# Altium schematic sheet REGENIX_DRIVER.SchDoc
size A4; SheetNumber: 11; SheetTotal: 12
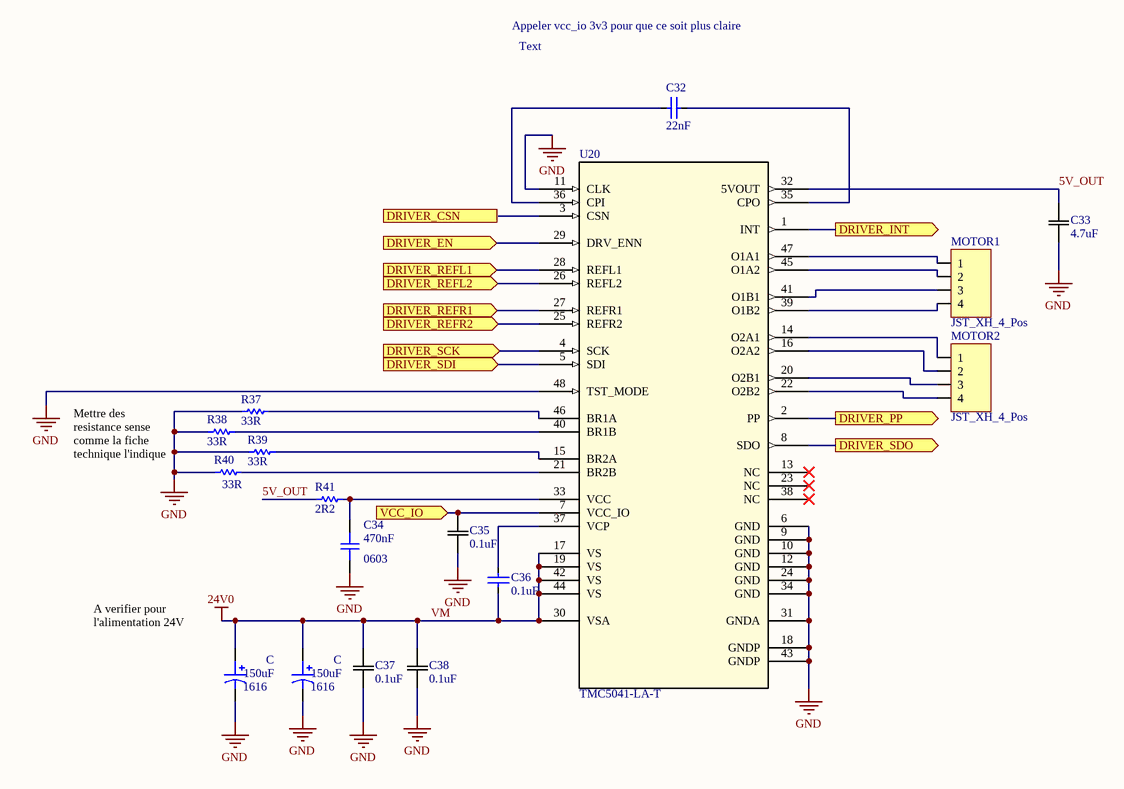
[diagram p0: REGENIX_DRIVER.SchDoc]

## Parts
(Parts that share a designator on the sheet are numbered #1, #2 ... from top to bottom, then left to right.)
C32  value 22nF  [CAPACITOR-0603]  (hidden comment: Capacitor-0603-0.22uF-25V-X7R)
C33  4.7uF  [CAP_CL21_SAM]
C34  value 470nF  Package: 0603  [CAP_0603]  (hidden comment: CAP - 0603)
C35  0.1uF  [CAP_CL10_SAM]
C36  value 0.1uF  [CAPACITOR-0603]  (hidden comment: Capacitor-0603-0.22uF-25V-X7R)
C37  0.1uF  [CAP_CL10_SAM]
C38  0.1uF  [CAP_CL10_SAM]
C#1  value 150uF  Package: 1616  [CAP_ALU_1616_vishay]  (hidden comment: MAL214699108E3)
C#2  value 150uF  Package: 1616  [CAP_ALU_1616_vishay]  (hidden comment: MAL214699108E3)
MOTOR1  JST_XH_4_Pos  [JST_XH_4_Pos]
MOTOR2  JST_XH_4_Pos  [JST_XH_4_Pos]
R37  value 33R  [RESISTOR-1206]  (hidden comment: SMT resistor)
R38  value 33R  [RESISTOR-1206]  (hidden comment: SMT resistor)
R39  value 33R  [RESISTOR-1206]  (hidden comment: SMT resistor)
R40  value 33R  [RESISTOR-1206]  (hidden comment: SMT resistor)
R41  value 2R2  [Resistor-0603]  (hidden comment: SMT resistor)
U20  TMC5041-LA-T  [QFN48_7X7_TRI]

## Ports
DRIVER_CSN (in), DRIVER_EN (in), DRIVER_INT (out), DRIVER_PP (out), DRIVER_REFL1 (in), DRIVER_REFL2 (in), DRIVER_REFR1 (in), DRIVER_REFR2 (in), DRIVER_SCK (in), DRIVER_SDI (in), DRIVER_SDO (out), VCC_IO (in)

## Nets
GND: C33.1 C34.1 C35.1 C37.1 C38.1 C#1.2 C#2.2 R37.1 R38.1 R39.1 R40.1 U20.6(GND) U20.9(GND) U20.10(GND) U20.11(CLK) U20.12(GND) U20.18(GNDP) U20.24(GND) U20.31(GNDA) U20.34(GND) U20.43(GNDP) U20.48(TST_MODE)
VM: C36.1 C37.2 C38.2 C#1.1 C#2.1 U20.17(VS) U20.19(VS) U20.30(VSA) U20.42(VS) U20.44(VS)  [also labelled 24V0]
5V_OUT: C33.2 R41.1 U20.32(5VOUT)
DRIVER_EN: U20.29(DRV_ENN) ; port DRIVER_EN
DRIVER_INT: U20.1(INT) ; port DRIVER_INT
DRIVER_PP: U20.2(PP) ; port DRIVER_PP
DRIVER_REFL1: U20.28(REFL1) ; port DRIVER_REFL1
DRIVER_REFL2: U20.26(REFL2) ; port DRIVER_REFL2
DRIVER_REFR1: U20.27(REFR1) ; port DRIVER_REFR1
DRIVER_REFR2: U20.25(REFR2) ; port DRIVER_REFR2
DRIVER_SCK: U20.4(SCK) ; port DRIVER_SCK
DRIVER_SDI: U20.5(SDI) ; port DRIVER_SDI
DRIVER_SDO: U20.8(SDO) ; port DRIVER_SDO
VCC_IO: C35.2 U20.7(VCC_IO) ; port VCC_IO
NetC32_1: C32.1 U20.36(CPI)
NetC32_2: C32.2 U20.35(CPO)
NetC34_2: C34.2 R41.2 U20.33(VCC)
NetC36_2: C36.2 U20.37(VCP)
NetMOTOR1_1: MOTOR1.1 U20.47(O1A1)
NetMOTOR1_2: MOTOR1.2 U20.45(O1A2)
NetMOTOR1_3: MOTOR1.3 U20.41(O1B1)
NetMOTOR1_4: MOTOR1.4 U20.39(O1B2)
NetMOTOR2_1: MOTOR2.1 U20.14(O2A1)
NetMOTOR2_2: MOTOR2.2 U20.16(O2A2)
NetMOTOR2_3: MOTOR2.3 U20.20(O2B1)
NetMOTOR2_4: MOTOR2.4 U20.22(O2B2)
NetR37_2: R37.2 U20.46(BR1A)
NetR38_2: R38.2 U20.40(BR1B)
NetR39_2: R39.2 U20.15(BR2A)
NetR40_2: R40.2 U20.21(BR2B)

Not connected (* = marked no-connect by the designer): U20 3(CSN) 13(NC)* 23(NC)* 38(NC)*

## Notes on the sheet
- Appeler vcc_io 3v3 pour que ce soit plus claire
- Text
- Mettre des resistance sense comme la fiche technique l'indique
- (near C#1) A verifier pour l'alimentation 24V

## Library data of the parts
C32 C36 = Capacitor-0603-0.22uF-25V-X7R: Precision: X7R-10%; Volt: 25V; Package / Case: Metric 1608, EIA 0603; Mounted: Yes; Supplier 1: Digi-Key; Supplier Part Number 1: 490-4935-2-ND; Supplier 2: Digi-Key; Supplier 3: Digi-Key; Supplier 4: Digi-Key
C33 = CL21A475KAQNNNE: CAP CER 4.7UF 25V X5R 0805  CL21A475KAQNNNE; Mfr_Name: Samsung
C34 = CAP - 0603: Precision: 10%; Current: *; CreatedBy: Jonathan Bouchard; Power: *
C35 C37 C38 = CL10B104KB8NNWC: CAP CER 0.1UF 50V X7R 0603 CL10B104KB8NNWC; Mfr_Name: Samsung
C#1 C#2 = CAP_ALU_MAL214699108E3: CAP - ALU 470uF 20% 50V - 1616; Current: 1.3A; Mfg: Vishay Dale; Mfg Part Number: MAL214699108E3; HelpURL: http://www.vishay.com/docs/28403/146cti.pdf; CreatedBy: Jonathan Bouchard; Temperature: -55°C to 125°C; Power: *; Supplier 1: Digikey; Supplier Part Number 1: 4442PHCT-ND
MOTOR1 MOTOR2 = JST_XH_4_Pos: CONN HEADER VERT 4POS 2.5MM; Supplier 1: Digi-Key; Supplier Part Number 1: 455-2237-ND; Mounted: Yes; Package / Case: TH; Volt: N/A
R37-R40 = Resistor1206-33R: Precision: 1%; Watt: 0.1W; Mounted: Yes; Package / Case: Metric 3216, EIA 1206; Supplier 2: Digi-Key; Supplier 4: Digi-Key; Supplier 1: Digi-Key; Supplier 3: Digi-Key; Supplier Part Number 1: 311-33.0FRTR-ND
R41 = Resistor0603-22R: Precision: 1%; Watt: 0.1W; Mounted: Yes; Package / Case: Metric 1608, EIA 0603; Supplier 2: Digi-Key; Supplier 4: Digi-Key; Supplier 1: Digi-Key; Supplier 3: Digi-Key; Supplier Part Number 1: RMCF0603FT22R0CT-ND
U20 = TMC5041-LA-T: No Description Available; Mfr_Name: Analog Devices / Trinamic; RefDes: RefDes; Type: Type